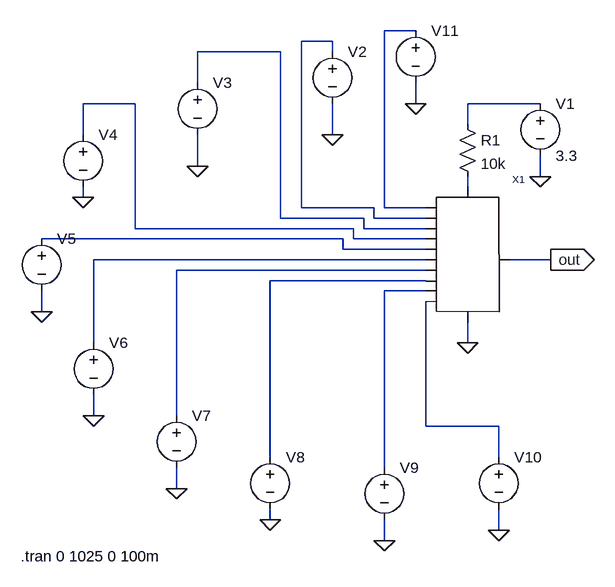
[diagram p0: schematic 10bitdac.asc]
10bitdac.asc, the LTspice schematic file:
Version 4
SHEET 1 880 680
WIRE 112 -192 64 -192
WIRE -16 -176 -64 -176
WIRE -96 -160 -224 -160
WIRE -16 -160 -16 -176
WIRE -224 -112 -224 -160
WIRE -320 -80 -400 -80
WIRE 112 -80 112 -112
WIRE 304 -80 192 -80
WIRE 192 -48 192 -80
WIRE -400 -32 -400 -80
WIRE -16 -32 -16 -80
WIRE -224 16 -224 -32
WIRE 304 32 304 0
WIRE 192 48 192 32
WIRE -400 64 -400 48
WIRE -64 80 -64 -176
WIRE 48 80 -64 80
WIRE 64 80 64 -192
WIRE 128 80 64 80
WIRE -96 96 -96 -160
WIRE 32 96 -96 96
WIRE 48 96 48 80
WIRE 128 96 48 96
WIRE -320 112 -320 -80
WIRE 16 112 -320 112
WIRE 32 112 32 96
WIRE 128 112 32 112
WIRE 0 128 -464 128
WIRE 16 128 16 112
WIRE 128 128 16 128
WIRE 0 144 0 128
WIRE 128 144 0 144
WIRE 128 160 -384 160
WIRE 320 160 256 160
WIRE 128 176 -256 176
WIRE 128 192 -112 192
WIRE 128 208 64 208
WIRE -464 240 -464 208
WIRE -384 288 -384 160
WIRE 192 288 192 256
WIRE -384 400 -384 368
WIRE -256 400 -256 176
WIRE 128 416 128 224
WIRE 240 416 128 416
WIRE -112 464 -112 192
WIRE 240 464 240 416
WIRE 64 480 64 208
WIRE -256 512 -256 480
WIRE -112 560 -112 544
WIRE 240 576 240 544
WIRE 64 592 64 560
FLAG 192 288 0
FLAG 304 32 0
FLAG 112 -80 0
FLAG -16 -32 0
FLAG -224 16 0
FLAG -400 64 0
FLAG -464 240 0
FLAG -384 400 0
FLAG -256 512 0
FLAG -112 560 0
FLAG 64 592 0
FLAG 240 576 0
FLAG 320 160 out
IOPIN 320 160 Out
SYMBOL level9 192 144 R0
SYMATTR InstName X1
SYMBOL res 176 -64 R0
SYMATTR InstName R1
SYMATTR Value 10k
SYMBOL voltage 304 -96 R0
WINDOW 123 0 0 Left 0
WINDOW 39 0 0 Left 0
SYMATTR InstName V1
SYMATTR Value 3.3
SYMBOL voltage -16 -176 R0
WINDOW 123 0 0 Left 0
WINDOW 39 0 0 Left 0
WINDOW 3 24 96 Invisible 2
SYMATTR InstName V2
SYMATTR Value PULSE(0 1.8 10m 1n 1n 2 4 256)
SYMBOL voltage -224 -128 R0
WINDOW 123 0 0 Left 0
WINDOW 39 0 0 Left 0
WINDOW 3 24 96 Invisible 2
SYMATTR InstName V3
SYMATTR Value PULSE(0 1.8 10m 1n 1n 4 8 128)
SYMBOL voltage -400 -48 R0
WINDOW 123 0 0 Left 0
WINDOW 39 0 0 Left 0
WINDOW 3 24 96 Invisible 2
SYMATTR InstName V4
SYMATTR Value PULSE(0 1.8 10m 1n 1n 8 16 64)
SYMBOL voltage -464 112 R0
WINDOW 123 0 0 Left 0
WINDOW 39 0 0 Left 0
WINDOW 3 24 96 Invisible 2
SYMATTR InstName V5
SYMATTR Value PULSE(0 1.8 10m 1n 1n 16 32 32)
SYMBOL voltage -384 272 R0
WINDOW 123 0 0 Left 0
WINDOW 39 0 0 Left 0
WINDOW 3 24 96 Invisible 2
SYMATTR InstName V6
SYMATTR Value PULSE(0 1.8 10m 1n 1n 32 64 16)
SYMBOL voltage -256 384 R0
WINDOW 123 0 0 Left 0
WINDOW 39 0 0 Left 0
WINDOW 3 24 96 Invisible 2
SYMATTR InstName V7
SYMATTR Value PULSE(0 1.8 10m 1n 1n 64 128 8)
SYMBOL voltage -112 448 R0
WINDOW 123 0 0 Left 0
WINDOW 39 0 0 Left 0
WINDOW 3 24 96 Invisible 2
SYMATTR InstName V8
SYMATTR Value PULSE(0 1.8 10m 1n 1n 128 256 4)
SYMBOL voltage 64 464 R0
WINDOW 123 0 0 Left 0
WINDOW 39 0 0 Left 0
WINDOW 3 24 96 Invisible 2
SYMATTR InstName V9
SYMATTR Value PULSE(0 1.8 10m 1n 1n 256 512 2)
SYMBOL voltage 240 448 R0
WINDOW 123 0 0 Left 0
WINDOW 39 0 0 Left 0
WINDOW 3 24 96 Invisible 2
SYMATTR InstName V10
SYMATTR Value PULSE(0 1.8 10m 1n 1n 512 1024 1)
SYMBOL voltage 112 -208 R0
WINDOW 123 0 0 Left 0
WINDOW 39 0 0 Left 0
WINDOW 3 24 96 Invisible 2
SYMATTR InstName V11
SYMATTR Value PULSE(0 1.8 10m 1n 1n 1 2 512)
TEXT -496 616 Left 2 !.tran 0 1025 0 100m

The netlist it stands for:
* 10bitdac.asc
XX1 N001 N002 N003 N004 N007 N008 N009 N010 N011 N012 out N006 0 level9  ; pins d0 d1 d2 d3 d4 d5 d6 d7 d8 d9 out_10 res_in10 res_out10
R1 N005 N006 10k
V1 N005 0 3.3
V2 N002 0 PULSE(0 1.8 10m 1n 1n 2 4 256)
V3 N003 0 PULSE(0 1.8 10m 1n 1n 4 8 128)
V4 N004 0 PULSE(0 1.8 10m 1n 1n 8 16 64)
V5 N007 0 PULSE(0 1.8 10m 1n 1n 16 32 32)
V6 N008 0 PULSE(0 1.8 10m 1n 1n 32 64 16)
V7 N009 0 PULSE(0 1.8 10m 1n 1n 64 128 8)
V8 N010 0 PULSE(0 1.8 10m 1n 1n 128 256 4)
V9 N011 0 PULSE(0 1.8 10m 1n 1n 256 512 2)
V10 N012 0 PULSE(0 1.8 10m 1n 1n 512 1024 1)
V11 N001 0 PULSE(0 1.8 10m 1n 1n 1 2 512)
.tran 0 1025 0 100m
.backanno
.end